# Altium project PCB_Project_1.PrjPcb
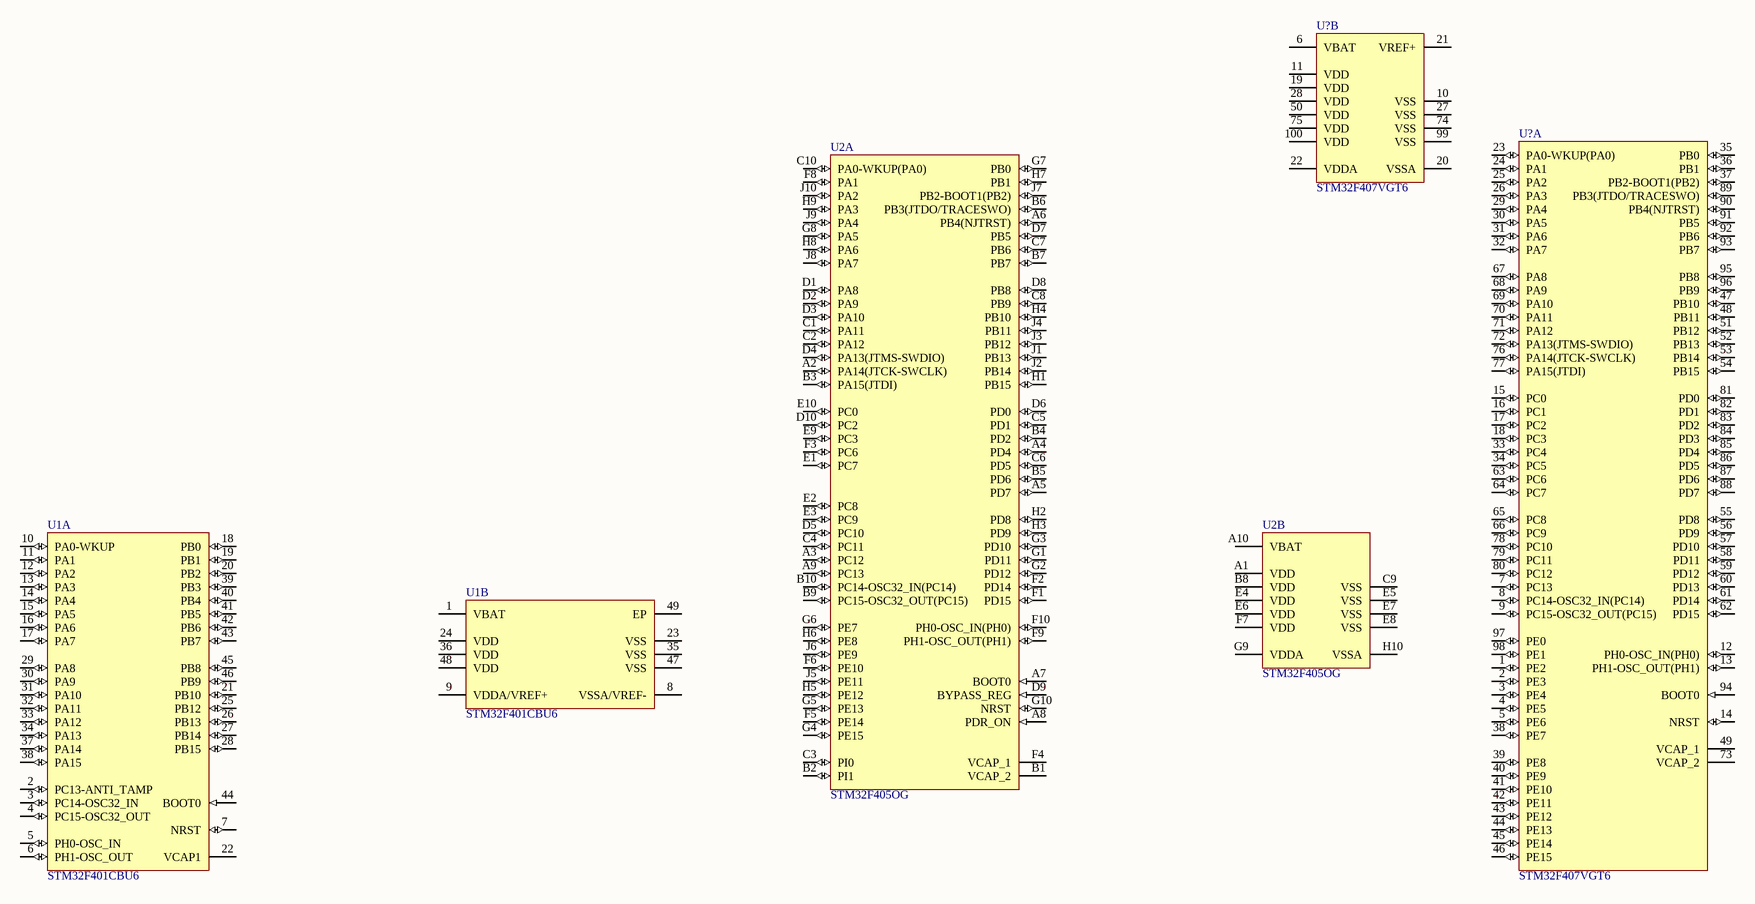
[diagram p0: Sheet2.SchDoc]
1 sheet, 4 parts. Net scope: global (net labels, ports and power ports of the same name join across sheets).
Board file: PCB2.PcbDoc

## Sheet Sheet2.SchDoc
size A3; SheetNumber: 1; SheetTotal: 1

### Parts
(Parts that share a designator on the sheet are numbered #1, #2 ... from top to bottom, then left to right.)
U1  STM32F401CBU6  [STM-UFQFPN48_N]  (parts A,B of 2)
U2  STM32F405OG  [STM-WLCSP90]  (parts A,B of 2)
U?#1  STM32F407VGT6  [STM-LQFP100_N]  (part B of 2)
U?#2  STM32F407VGT6  [STM-LQFP100_N]  (part A of 2)

### Nets

Not connected (* = marked no-connect by the designer): U1 1(VBAT) 2(PC13-ANTI_TAMP) 3(PC14-OSC32_IN) 4(PC15-OSC32_OUT) 5(PH0-OSC_IN) 6(PH1-OSC_OUT) 7(NRST) 8(VSSA/VREF-) 9(VDDA/VREF+) 10(PA0-WKUP) 11(PA1) 12(PA2) 13(PA3) 14(PA4) 15(PA5) 16(PA6) 17(PA7) 18(PB0) 19(PB1) 20(PB2) 21(PB10) 22(VCAP1) 23(VSS) 24(VDD) 25(PB12) 26(PB13) 27(PB14) 28(PB15) 29(PA8) 30(PA9) 31(PA10) 32(PA11) 33(PA12) 34(PA13) 35(VSS) 36(VDD) 37(PA14) 38(PA15) 39(PB3) 40(PB4) 41(PB5) 42(PB6) 43(PB7) 44(BOOT0) 45(PB8) 46(PB9) 47(VSS) 48(VDD) 49(EP); U2 A1(VDD) A2(PA14(JTCK-SWCLK)) A3(PC12) A4(PD4) A5(PD7) A6(PB4(NJTRST)) A7(BOOT0) A8(PDR_ON) A9(PC13) A10(VBAT) B1(VCAP_2) B2(PI1) B3(PA15(JTDI)) B4(PD2) B5(PD6) B6(PB3(JTDO/TRACESWO)) B7(PB7) B8(VDD) B9(PC15-OSC32_OUT(PC15)) B10(PC14-OSC32_IN(PC14)) C1(PA11) C2(PA12) C3(PI0) C4(PC11) C5(PD1) C6(PD5) C7(PB6) C8(PB9) C9(VSS) C10(PA0-WKUP(PA0)) D1(PA8) D2(PA9) D3(PA10) D4(PA13(JTMS-SWDIO)) D5(PC10) D6(PD0) D7(PB5) D8(PB8) D9(BYPASS_REG) D10(PC2) E1(PC7) E2(PC8) E3(PC9) E4(VDD) E5(VSS) E6(VDD) E7(VSS) E8(VSS) E9(PC3) E10(PC0) F1(PD15) F2(PD14) F3(PC6) F4(VCAP_1) F5(PE14) F6(PE10) F7(VDD) F8(PA1) F9(PH1-OSC_OUT(PH1)) F10(PH0-OSC_IN(PH0)) G1(PD11) G2(PD12) G3(PD10) G4(PE15) G5(PE13) G6(PE7) G7(PB0) G8(PA5) G9(VDDA) G10(NRST) H1(PB15) H2(PD8) H3(PD9) H4(PB10) H5(PE12) H6(PE8) H7(PB1) H8(PA6) H9(PA3) H10(VSSA) J1(PB13) J2(PB14) J3(PB12) J4(PB11) J5(PE11) J6(PE9) J7(PB2-BOOT1(PB2)) J8(PA7) J9(PA4) J10(PA2); U?#1 6(VBAT) 10(VSS) 11(VDD) 19(VDD) 20(VSSA) 21(VREF+) 22(VDDA) 27(VSS) 28(VDD) 50(VDD) 74(VSS) 75(VDD) 99(VSS) 100(VDD); U?#2 1(PE2) 2(PE3) 3(PE4) 4(PE5) 5(PE6) 7(PC13) 8(PC14-OSC32_IN(PC14)) 9(PC15-OSC32_OUT(PC15)) 12(PH0-OSC_IN(PH0)) 13(PH1-OSC_OUT(PH1)) 14(NRST) 15(PC0) 16(PC1) 17(PC2) 18(PC3) 23(PA0-WKUP(PA0)) 24(PA1) 25(PA2) 26(PA3) 29(PA4) 30(PA5) 31(PA6) 32(PA7) 33(PC4) 34(PC5) 35(PB0) 36(PB1) 37(PB2-BOOT1(PB2)) 38(PE7) 39(PE8) 40(PE9) 41(PE10) 42(PE11) 43(PE12) 44(PE13) 45(PE14) 46(PE15) 47(PB10) 48(PB11) 49(VCAP_1) 51(PB12) 52(PB13) 53(PB14) 54(PB15) 55(PD8) 56(PD9) 57(PD10) 58(PD11) 59(PD12) 60(PD13) 61(PD14) 62(PD15) 63(PC6) 64(PC7) 65(PC8) 66(PC9) 67(PA8) 68(PA9) 69(PA10) 70(PA11) 71(PA12) 72(PA13(JTMS-SWDIO)) 73(VCAP_2) 76(PA14(JTCK-SWCLK)) 77(PA15(JTDI)) 78(PC10) 79(PC11) 80(PC12) 81(PD0) 82(PD1) 83(PD2) 84(PD3) 85(PD4) 86(PD5) 87(PD6) 88(PD7) 89(PB3(JTDO/TRACESWO)) 90(PB4(NJTRST)) 91(PB5) 92(PB6) 93(PB7) 94(BOOT0) 95(PB8) 96(PB9) 97(PE0) 98(PE1)

### Library data of the parts
U1 = STM32F401CBU6: ARM Cortex-M4 32-bit MCU+FPU, 105 DMIPS, 128 kB Flash, 64 kB Internal RAM, 36 I/Os, 48-pin UFQFPN, -40 to 85 degC, Tray; Manufacturer: STMicroelectronics; FLASH Size (Prog) (kB): 128; I/Os (High Current): 36; Internal RAM Size (kB): 64; Operating Frequency(F) (Processor speed) (MHz): 84; Supply Voltage(Vcc) max (V): 3.6; Supply Voltage(Vcc) min (V): 1.8; DatasheetVersion: Rev. 1; PackageVersion: Rev. 1, 04/2013; PackageReference: UFQFPN48; PackageDescription: 48-Pin Ultra Thin Fine Pitch Quad Flat No-Lead, 7 x 7 x 0.6 mm Body, 0.5 mm Pitch, Exposed Pad; Supplier 1: Newark; Supplier Part Number 1: 19X6215; Supplier 2: Mouser; Supplier Part Number 2: 511-STM32F401CBU6; Core: ARM Cortex-M4; Packing: Tray; Mounting Technology: Surface Mount; PartNumber: STM32F401CBU6; ComponentLink1Description: Manufacturer URL; ComponentLink1URL: http://www.st.com/web/en/home.html; ComponentLink2Description: Datasheet; ComponentLink2URL: http://www.st.com/st-web-ui/static/active/en/resource/technical/document/data_brief/DM00071938.pdf; ComponentLink3Description: Package Specification; ComponentLink3URL: http://www.st.com/st-web-ui/static/active/en/resource/technical/document/data_brief/DM00071938.pdf
U2 = STM32F405OG: ARM Cortex-M4 32-bit MCU+FPU, 210 DMIPS, 1024 kB Flash, 192 kB Internal RAM, 72 I/Os, 90-pin WLCSP; Manufacturer: STMicroelectronics; D/A Converter: 2x12-bit; FLASH Size (Prog) (kB): 1024; I/Os (High Current): 72; Internal RAM Size (kB): 192; Operating Frequency(F) (Processor speed) (MHz): 168; Supply Voltage(Vcc) max (V): 3.6; Supply Voltage(Vcc) min (V): 1.8; DatasheetVersion: Rev. 4; PackageVersion: Rev. 4, 06/2013; PackageReference: WLCSP90; PackageDescription: 90-Ball Wafer Level Chip Size Package, 0.4 mm Pitch; Core: ARM Cortex-M4; Mounting Technology: Surface Mount; PartNumber: STM32F405OG; ComponentLink1Description: Manufacturer URL; ComponentLink1URL: http://www.st.com/web/en/home.html; ComponentLink2Description: Datasheet; ComponentLink2URL: http://www.st.com/st-web-ui/static/active/en/resource/technical/document/datasheet/DM00037051.pdf; ComponentLink3Description: Package Specification; ComponentLink3URL: http://www.st.com/st-web-ui/static/active/en/resource/technical/document/datasheet/DM00035129.pdf
U?#1 U?#2 = STM32F407VGT6: ARM Cortex-M4 32-bit MCU+FPU, 210 DMIPS, 1024 kB Flash, 192 kB Internal RAM, 82 I/Os, 100-pin LQFP, -40 to 85 degC, Tray; Manufacturer: STMicroelectronics; D/A Converter: 2x12-bit; FLASH Size (Prog) (kB): 1024; I/Os (High Current): 82; Internal RAM Size (kB): 192; Operating Frequency(F) (Processor speed) (MHz): 168; Supply Voltage(Vcc) max (V): 3.6; Supply Voltage(Vcc) min (V): 1.8; DatasheetVersion: Rev. 4; PackageVersion: Rev. 1, 06/2013; PackageReference: LQFP100; PackageDescription: 100-Pin Low Profile Quad Flat Package, 14 x 14 mm Body, 0.5 mm Pitch; Supplier 1: Digi-Key; Supplier Part Number 1: 497-11605-ND; Supplier 2: Farnell; Supplier Part Number 2: 2064368; Supplier 3: Newark; Supplier Part Number 3: 73T2333; Supplier 4: Mouser; Supplier Part Number 4: 511-STM32F407VGT6; Core: ARM Cortex-M4; Packing: Tray; Mounting Technology: Surface Mount; PartNumber: STM32F407VGT6; ComponentLink1Description: Manufacturer URL; ComponentLink1URL: http://www.st.com/web/en/home.html; ComponentLink2Description: Datasheet; ComponentLink2URL: http://www.st.com/st-web-ui/static/active/en/resource/technical/document/datasheet/DM00037051.pdf; ComponentLink3Description: Package Specification; ComponentLink3URL: http://www.st.com/st-web-ui/static/active/en/resource/technical/document/data_brief/DM00071938.pdf